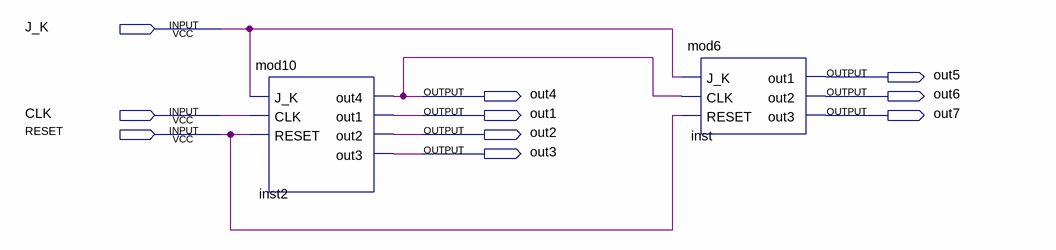
[diagram p0: schematic sheet]
// Quartus schematic mod60.bdf as structural Verilog: 2 symbols, 10 pins
module mod60 (
  input  J_K,
  input  CLK,
  input  RESET,
  output out5,
  output out4,
  output out6,
  output out1,
  output out7,
  output out2,
  output out3
);

  mod10 inst2 (.J_K(J_K), .CLK(CLK), .RESET(RESET), .out4(out4), .out1(out1), .out2(out2), .out3(out3));
  mod6 inst (.J_K(J_K), .CLK(out4), .RESET(RESET), .out1(out5), .out2(out6), .out3(out7));
endmodule
